# EAGLE schematic bjt-ce (EAGLE 9.6.1)
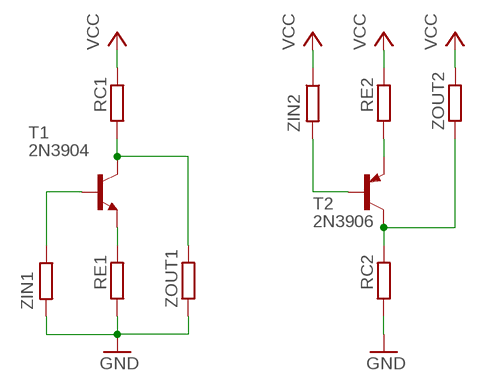
[diagram p0: schematic, sheet 1]

## Parts
RC1  R-EU_0207/10  [0207/10]
RC2  R-EU_0207/10  [0207/10]
RE1  R-EU_0207/10  [0207/10]
RE2  R-EU_0207/10  [0207/10]
T1  2N3904  [TO92]
T2  2N3906  [TO92]
ZIN1  R-EU_0207/10  [0207/10]
ZIN2  R-EU_0207/10  [0207/10]
ZOUT1  R-EU_0207/10  [0207/10]
ZOUT2  R-EU_0207/10  [0207/10]

## Nets
GND: RC2.1 RE1.1 ZIN1.2 ZOUT1.1
N$1: T1.2(B) ZIN1.1
N$2: RC1.1 T1.1(C) ZOUT1.2
N$3: RC2.2 T2.1(C) ZOUT2.1
N$4: T2.2(B) ZIN2.2
N$5: RE1.2 T1.3(E)
N$7: RE2.1 T2.3(E)
VCC: RC1.2 RE2.2 ZIN2.1 ZOUT2.2

## Library data of the parts
RC1 RC2 RE1 RE2 ZIN1 ZIN2 ZOUT1 ZOUT2 = rcl:R-EU_: RESISTOR, European symbol; SPICEPREFIX: R
T1 = transistor:2N3904: NPN TRANSISTOR
T2 = transistor-pnp:2N3906: PNP Transistor